# Altium project Current Sensing Board.PrjPCB
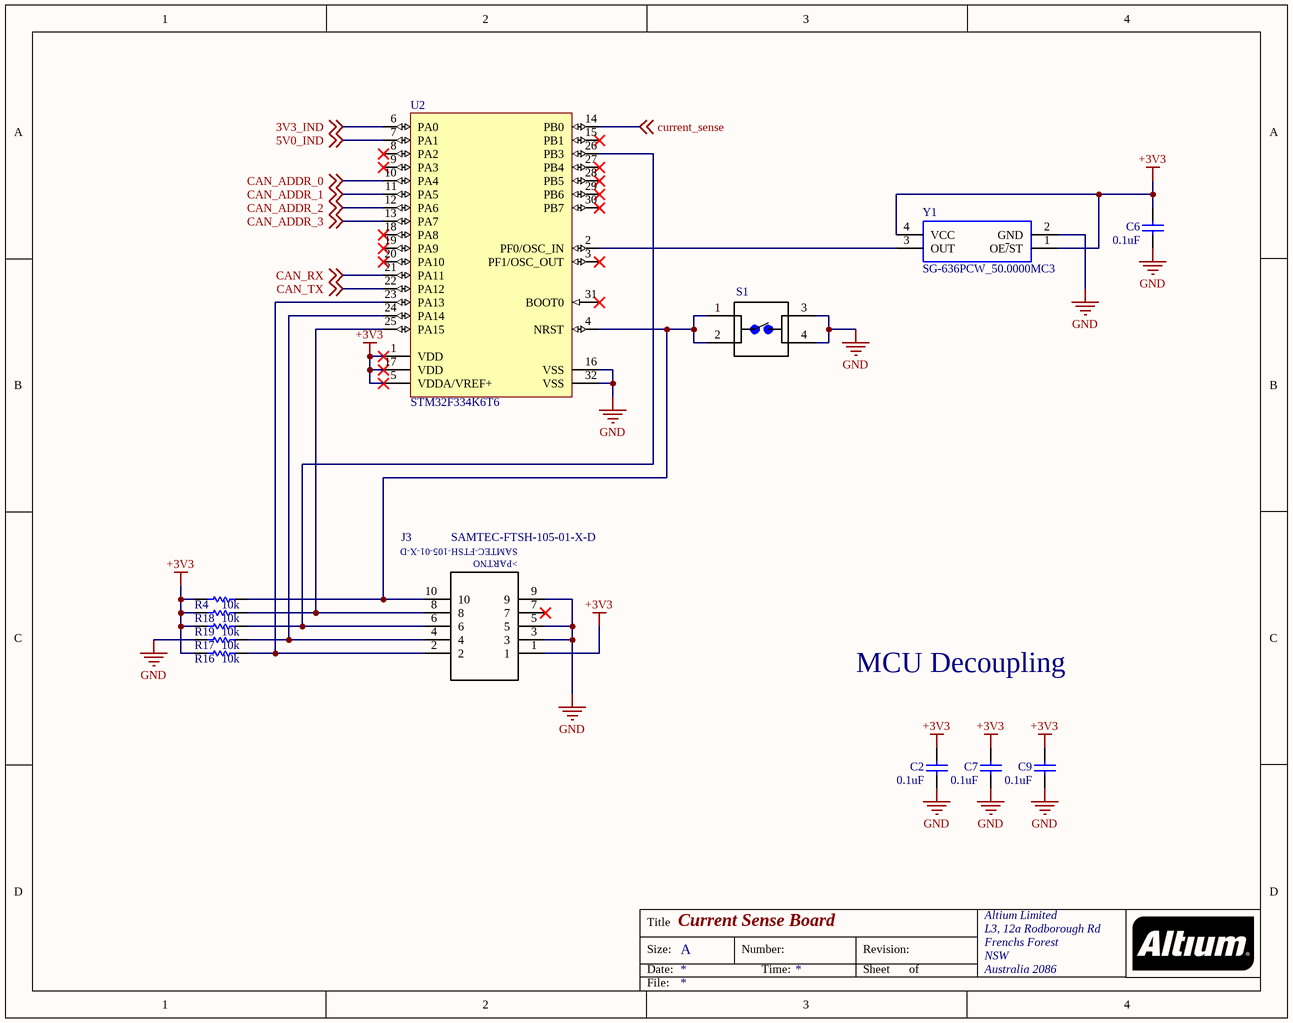
[diagram p0: STM Schematic.SchDoc]
Title: Current Sense Board
4 sheets, 56 parts. Net scope: global (net labels, ports and power ports of the same name join across sheets).
Board file: Current Sensing PCB.PcbDoc
Sheets:
  STM Schematic.SchDoc
  CAN Schematic.SchDoc
  Power Schematic.SchDoc
  Current Sense Schematic.SchDoc

## Sheet STM Schematic.SchDoc: Current Sense Board
size A; Organization: Altium Limited; Address1: L3, 12a Rodborough Rd; Address2: Frenchs Forest; Address3: NSW; Address4: Australia 2086

### Parts
C2  0.1uF  [CAPC0805(2012)75_L]
C6  0.1uF  [CAPC0805(2012)75_L]
C7  0.1uF  [CAPC0805(2012)75_L]
C9  0.1uF  [CAPC0805(2012)75_L]
J3  SAMTEC-FTSH-105-01-X-D  [SAMTEC-FTSH-105-01-X-D]
R4  10k  [RESC2013X70X40LL20T20]
R16  10k  [RESC2013X70X40LL20T20]
R17  10k  [RESC2013X70X40LL20T20]
R18  10k  [RESC2013X70X40LL20T20]
R19  10k  [RESC2013X70X40LL20T20]
S1  1825910-7  [Switch 6mm 24V (NO)]  (value not drawn)
U2  STM32F334K6T6  [STM-LQFP32_N]
Y1  SG-636PCW_50.0000MC3  [SG-636]

### Nets
+3V3: C2.2 C6.2 C7.2 C9.2 J3.1 R4.1 R16.1 R18.1 R19.1 U2.1(VDD) U2.5(VDDA/VREF+) U2.17(VDD) Y1.1(OE~{/}ST) Y1.4(VCC)
GND: C2.1 C6.1 C7.1 C9.1 J3.3 J3.5 J3.9 R17.1 S1.3 S1.4 U2.16(VSS) U2.32(VSS) Y1.2(GND)
3V3_IND: U2.6(PA0) ; off-sheet 3V3_IND
5V0_IND: U2.7(PA1) ; off-sheet 5V0_IND
CAN_ADDR_0: U2.10(PA4) ; off-sheet CAN_ADDR_0
CAN_ADDR_1: U2.11(PA5) ; off-sheet CAN_ADDR_1
CAN_ADDR_2: U2.12(PA6) ; off-sheet CAN_ADDR_2
CAN_ADDR_3: U2.13(PA7) ; off-sheet CAN_ADDR_3
CAN_RX: U2.21(PA11) ; off-sheet CAN_RX
CAN_TX: U2.22(PA12) ; off-sheet CAN_TX
current_sense: U2.14(PB0) ; off-sheet current_sense
NetJ3_2: J3.2 R16.2 U2.23(PA13)
NetJ3_4: J3.4 R17.2 U2.24(PA14)
NetJ3_6: J3.6 R19.2 U2.26(PB3)
NetJ3_8: J3.8 R18.2 U2.25(PA15)
NetJ3_10: J3.10 R4.2 S1.1 S1.2 U2.4(NRST)
NetU2_2: U2.2(PF0/OSC_IN) Y1.3(OUT)

Not connected (* = marked no-connect by the designer): J3 7*; U2 3(PF1/OSC_OUT)* 8(PA2)* 9(PA3)* 15(PB1)* 18(PA8)* 19(PA9)* 20(PA10)* 27(PB4)* 28(PB5)* 29(PB6)* 30(PB7)* 31(BOOT0)*

### Notes on the sheet
- MCU Decoupling
- Title
- Size:
- Date:
- A
- Number:
- Time:
- Revision:
- Sheet
- of
- File:
- (in symbol SAMTEC-FTSH-105-01-X-D) >PARTNO

### Library data of the parts
C2 C6 C7 C9 = CMP-1036-00339-1: CAP 2.7pF 50V ±0.1pF 0805 (2012 Metric) Thickness 0.75mm SMD; Case-EIA: 0805; Case-Metric: 2012; Tolerance: Â±0.1pF; Rated Voltage: 50 V; Value: 2.7pF; Max Thickness: 0.75 mm; Technology: SMT
R4 R16-R19 = CMP-2001-04440-2: RES SMD 150K OHM 1% 1/8W 0805; Manufacturer: Panasonic; Part Number: ERJ-6ENF1503V; Datasheet: http://industrial.panasonic.com/cdbs/www-data/pdf/RDA0000/AOA0000C86.pdf
S1 = Switch 6mm 24V (NO): FSM4JAH=6MM TACT SWITCH, HIGH TEMP; MF: TE Connectivity; Contact_Current_Rating: 50 mA; Configuration_Pole-Throw: Single Pole - Single Throw; Package: None; Digi-Key_Part_Number: 450-1804-ND; Digi-Key_Purchase_URL: https://www.digikey.com/product-detail/en/te-connectivity-alcoswitch-switches/1825910-7/450-1804-ND/1731414?utm_source=snapeda&utm_medium=aggregator&utm_campaign=symbol; MP: 1825910-7; SnapEDA_Link: https://www.snapeda.com/parts/1825910-7/TE%20Connectivity%20ALCOSWITCH%20Switches/view-part/?ref=snap; EU_RoHS_Compliance: Compliant; TE_purchase_URL: https://www.te.com/usa-en/product-1825910-7.html?te_bu=Cor&te_type=disp&te_campaign=seda_glo_cor-seda-global-disp-prtnr-fy19-seda-model-bom-cta_sma-317_1&elqCampaignId=32493; Value: *
U2 = STM32F334K6T6: ARM Cortex-M4 32-bit MCU, 32-Pin LQFP, 32 KB Flash, 16 KB Internal RAM, 25 I/Os, -40 to 85 degC, Tray; D/A Converter: 3; Internal RAM Size (kB): 16; I/Os (High Current): 25; Supply Voltage(Vcc) min (V): 2; Operating Frequency(F) (Processor speed) (MHz): 72; FLASH Size (Prog) (kB): 32; ComponentLink1Description: Manufacturer URL; Mounting Technology: Surface Mount; ComponentLink1URL: http://www.st.com/; Package Description: 32-Pin Low Profile Quad Flat Package, 7 x 7 mm Body, 0.8 mm Pitch; ComponentLink2URL: http://www.st.com/st-web-ui/static/active/en/resource/technical/document/datasheet/DM00097745.pdf; Packing: Tray; Package Reference: LQFP32; Core: ARM Cortex-M4; ComponentLink2Description: Datasheet; DatasheetVersion: Rev. 4
Y1 = SG-636PCW_50.0000MC3__ROHS: Standard Clock Oscillators 50MHz 3.3Volt 100ppm -20C +70C; Manufacturer_Name: Epson Timing; Manufacturer_Part_Number: SG-636PCW 50.0000MC3: ROHS; RS Part Number: *; RS Price/Stock: *; Arrow Part Number: SG-636PCW 50.0000MC3: ROHS; Arrow Price/Stock: *; Datasheet Link: http://www.mouser.com/ds/2/137/G-636PCE_en-1003252.pdf

## Sheet CAN Schematic.SchDoc: Current Sense Board
size A
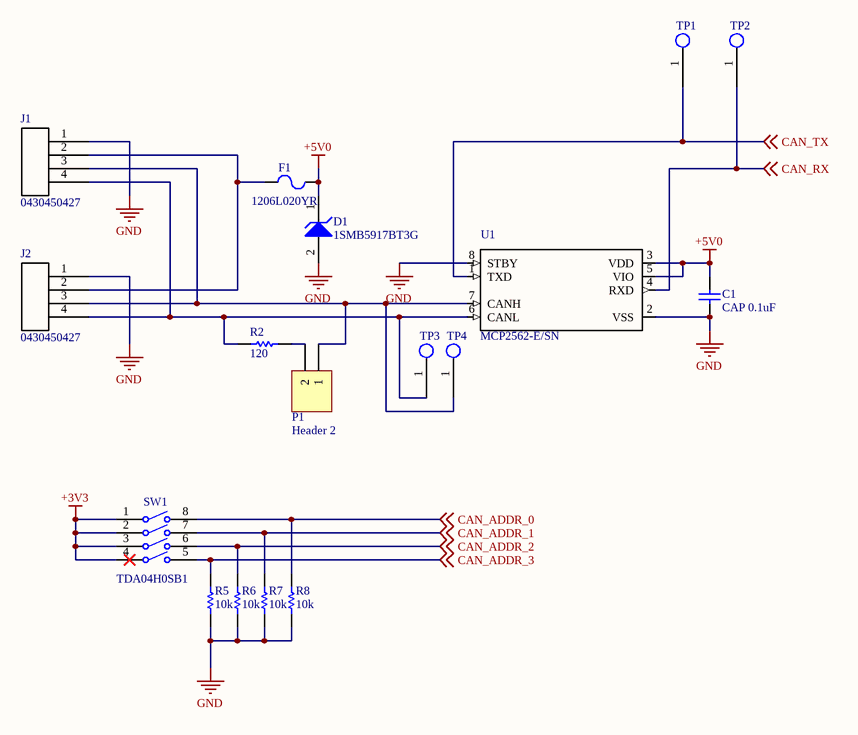
[diagram p1: CAN Schematic.SchDoc]

### Parts
C1  CAP 0.1uF  [CAPC0805(2012)75_L]
D1  1SMB5917BT3G  [ONSC-SMB-2-403A-03_H_V]
F1  1206L020YR  [LFUS-1206L020YR_V]
J1  0430450427  [0430450427]
J2  0430450427  [0430450427]
P1  Header 2  [HDR1X2]
R2  120  [RESC2013X70X40LL20T20]
R5  10k  [RESC2013X70X40LL20T20]
R6  10k  [RESC2013X70X40LL20T20]
R7  10k  [RESC2013X70X40LL20T20]
R8  10k  [RESC2013X70X40LL20T20]
SW1  TDA04H0SB1  [CKCP-TDA04H0SB1R_V]
TP1  Test Point  [Test Point Through-hole]  (value not drawn)
TP2  Test Point  [Test Point Through-hole]  (value not drawn)
TP3  Test Point  [Test Point Through-hole]  (value not drawn)
TP4  Test Point  [Test Point Through-hole]  (value not drawn)
U1  MCP2562-E/SN  [SOIC127P600X175-8N]

### Nets
+3V3: SW1.1 SW1.2 SW1.3 SW1.4
+5V0: C1.2 D1.1(K) F1.2 U1.3(VDD) U1.5(VIO)
GND: C1.1 D1.2(A) J1.1 J2.1 R5.2 R6.2 R7.2 R8.2 U1.2(VSS) U1.8(STBY)
CAN_ADDR_0: R8.1 SW1.8 ; off-sheet CAN_ADDR_0
CAN_ADDR_1: R7.1 SW1.7 ; off-sheet CAN_ADDR_1
CAN_ADDR_2: R6.1 SW1.6 ; off-sheet CAN_ADDR_2
CAN_ADDR_3: R5.1 SW1.5 ; off-sheet CAN_ADDR_3
CAN_RX: TP2.1 U1.4(RXD) ; off-sheet CAN_RX
CAN_TX: TP1.1 U1.1(TXD) ; off-sheet CAN_TX
NetF1_1: F1.1 J1.2 J2.2
NetJ1_3: J1.3 J2.3 P1.1 TP4.1 U1.7(CANH)
NetJ1_4: J1.4 J2.4 R2.2 TP3.1 U1.6(CANL)
NetP1_2: P1.2 R2.1

### Notes on the sheet
- Title
- Size:
- Date:
- A
- Number:
- Time:
- Revision:
- Sheet
- of
- File:

### Library data of the parts
C1 = CMP-1036-00339-1: as C2 on sheet STM Schematic; Rated Voltage: 50 V; Value: 2.7pF; Max Thickness: 0.75 mm; Technology: SMT
D1 = CMP-1060-00195-1: 3 W Zener Voltage Regulator, 2-Pin SMB, Pb-Free, Tape and Reel; Manufacturer: On Semiconductor; VZ Typ (V): 4.7; RoHS: Pb-Free; ComponentLink1Description: Manufacturer URL; ComponentLink2URL: http://www.onsemi.com/pub_link/Collateral/1SMB5913BT3-D.PDF; Mounting Technology: Surface Mount; PackageVersion: Rev. H, 05/2011; DatasheetVersion: Rev. 8; Packing: Tape and Reel; PartNumber: 1SMB5917BT3G; ComponentLink2Description: Datasheet; ComponentLink3Description: Package Specification; PackageReference: SMB-2-403A-03_H; ComponentLink1URL: http://www.onsemi.com/; PackageDescription: 2-Pin Small Molded Package, J-Bend Lead, Body 4.33 x 3.625 mm; ComponentLink3URL: http://www.onsemi.com/pub_link/Collateral/1SMB5913BT3-D.PDF
F1 = CMP-2000-05472-1: PTC Resettable Fuse, 100 A, 0.6W, -40 to 85 degC, 2-Pin SMD, RoHS, Tape and Reel; Manufacturer: Littelfuse; Hold Current [Ih]: 0.2A; Working Voltage-Max: 24V; Trip Current: 0.42A; Operating Temp Range: -40to+85°C; Size: 1206; Manufacturer URL: http://www.littelfuse.com/; Datasheet Version: 02/2015; Mounting Technology: SurfaceMount; Datasheet URL: http://download.siliconexpert.com/pdfs/2015/4/10/21/0/43/983/ltf_/manual/3609284120511713636092822459449496littelfuse_ptc_1206l_datasheet.pdf.pdf.pdf; Package Description: 2-Pin Surface Mount Device, Body 3.2 x 1.65 mm; Package Reference: 1206L020YR
J1 J2 = 0430450427-Single row schematic: Molex micro-fit 3.0 dual row header. P/N 0430450427
P1 = Header 2: Header, 2-Pin; LatestRevisionDate: 17-Jul-2002; LatestRevisionNote: Re-released for DXP Platform.; Publisher: Altium Limited
R2 R5-R8 = CMP-2001-04440-2: as R4 on sheet STM Schematic; Datasheet: http://industrial.panasonic.com/cdbs/www-data/pdf/RDA0000/AOA0000C86.pdf
SW1 = SMD Half-Pitch Dip Switch Array: Ultra-Miniature Surface Mount Half-Pitch DIP Switch, 25 mA, 24 V, -40 to 85 degC, 8-Pin SMD, RoHS, Tube; Contact Current Rating: 100 mA; Throw Configuration: SPST; Voltage Rating (DC): 24 V; Max Contact Resistance: 100 mohm; Max Current Rating: 25 mA; REACH SVHC: No SVHC; DatasheetVersion: 02/2016; Case\Package: DIP; Package Quantity: 70; Lead Pitch: 1.27 mm; Contact Plating: Gold; Packaging: Rail/Tube; Contact Finish: Gold; Mount: Surface Mount; Height: 2.3 mm; Contact Material: Copper; Max Operating Temperature: 85 degC; Max Voltage Rating (DC): 24 V; ComponentLink1URL: http://www.ck-components.com/media/1328/tda.pdf; PackageDescription: 8-Pin Surface Mount Device, Body 6.21 x 6.2 mm, Pitch 1.27 mm; Radiation Hardening: No; ComponentLink1Description: Datasheet; Current Rating: 100 mA; RoHSCompliant: true; PackageReference: TDA04H0SB1R; Min Operating Temperature: -40 degC; Pins: 4; Mounting Technology: Surface Mount; Length: 6.21 mm
U1 = MCP2562-E/SN: Microchip MCP2562-E/SN, CAN Transceiver 1MBps 1-channel IEC 61000-4-2, 8-Pin SOIC; Price: None; MF: Microchip; SnapEDA_Link: https://www.snapeda.com/parts/MCP2562-E/SN/Microchip/view-part/?ref=snap; MP: MCP2562-E/SN; Availability: Unavailable; Package: SO-8 Microchip; Value: *

## Sheet Power Schematic.SchDoc: Current Sense Board
size A
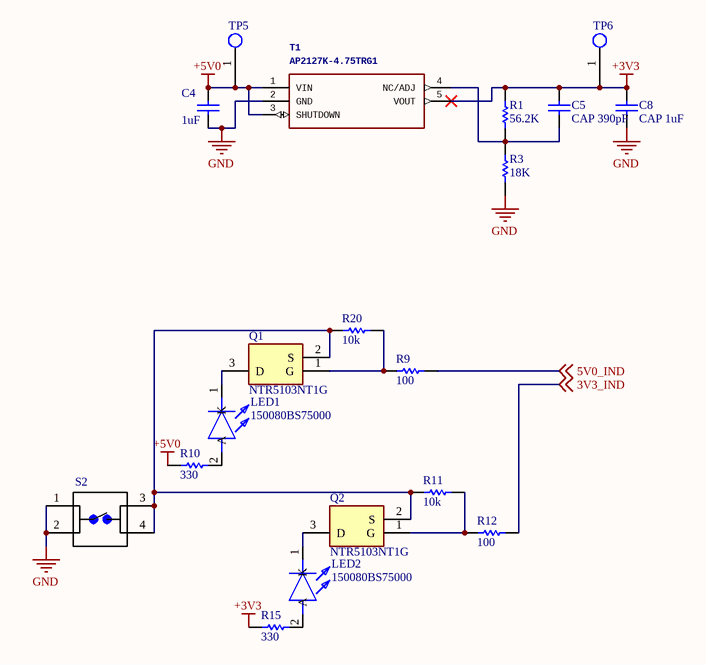
[diagram p2: Power Schematic.SchDoc]

### Parts
C4  1uF  [CAPC0805(2012)75_L]
C5  CAP 390pF  [CAPC0805(2012)75_L]
C8  CAP 1uF  [CAPC0805(2012)75_L]
LED1  150080BS75000  [LEDC2012X80N]
LED2  150080BS75000  [LEDC2012X80N]
Q1  NTR5103NT1G  [SOT95P237X101-3N]
Q2  NTR5103NT1G  [SOT95P237X101-3N]
R1  56.2K  [RESC2013X70X40LL20T20]
R3  18K  [RESC2013X70X40LL20T20]
R9  100  [RESC2013X70X40LL20T20]
R10  330  [RESC2013X70X40LL20T20]
R11  10k  [RESC2013X70X40LL20T20]
R12  100  [RESC2013X70X40LL20T20]
R15  330  [RESC2013X70X40LL20T20]
R20  10k  [RESC2013X70X40LL20T20]
S2  1825910-7  [Switch 6mm 24V (NO)]  (value not drawn)
T1  AP2127K-4.75TRG1  [SOT95P282X145-5N]
TP5  Test Point  [Test Point Through-hole]  (value not drawn)
TP6  Test Point  [Test Point Through-hole]  (value not drawn)

### Nets
+3V3: C5.2 C8.2 R1.1 R15.1 T1.5(VOUT) TP6.1
+5V0: C4.2 R10.2 T1.1(VIN) T1.3(SHUTDOWN) TP5.1
GND: C4.1 C8.1 R3.2 S2.1 S2.2 T1.2(GND)
3V3_IND: R12.1 ; off-sheet 3V3_IND
5V0_IND: R9.1 ; off-sheet 5V0_IND
NetC5_1: C5.1 R1.2 R3.1 T1.4(NC/ADJ)
NetLED1_1: LED1.1(K) Q1.3(D)
NetLED1_2: LED1.2(A) R10.1
NetLED2_1: LED2.1(K) Q2.3(D)
NetLED2_2: LED2.2(A) R15.2
NetQ1_1: Q1.1(G) R9.2 R20.1
NetQ1_2: Q1.2(S) Q2.2(S) R11.2 R20.2 S2.3 S2.4
NetQ2_1: Q2.1(G) R11.1 R12.2

### Notes on the sheet
- Title
- Size:
- Date:
- A
- Number:
- Time:
- Revision:
- Sheet
- of
- File:

### Library data of the parts
C4 C5 C8 = CMP-1036-00339-1: as C2 on sheet STM Schematic; Rated Voltage: 50 V; Value: 2.7pF; Max Thickness: 0.75 mm; Technology: SMT
LED1 LED2 = 150080BS75000: LED; Manufacturer_Name: Wurth Elektronik; Datasheet Link: https://katalog.we-online.com/led/datasheet/150080BS75000.pdf; Height: 0.8mm; Manufacturer_Part_Number: 150080BS75000; Mouser Part Number: 710-150080BS75000; Mouser Price/Stock: https://www.mouser.com/Search/Refine.aspx?Keyword=710-150080BS75000; RS Part Number: 8154228P; RS Price/Stock: http://uk.rs-online.com/web/p/products/8154228P
Q1 Q2 = NTR5103NT1G: N-MOSFET; Manufacturer_Name: ON Semiconductor; Datasheet Link: https://componentsearchengine.com/Datasheets/1/NTR5103NT1G.pdf; Height: 1.01mm; Manufacturer_Part_Number: NTR5103NT1G; Mouser Part Number: 863-NTR5103NT1G; Mouser Price/Stock: https://www.mouser.com/Search/Refine.aspx?Keyword=863-NTR5103NT1G; RS Part Number: 1841331; RS Price/Stock: http://uk.rs-online.com/web/p/products/1841331
R1 R3 R9-R12 R15 R20 = CMP-2001-04440-2: as R4 on sheet STM Schematic; Datasheet: http://industrial.panasonic.com/cdbs/www-data/pdf/RDA0000/AOA0000C86.pdf
S2 = Switch 6mm 24V (NO): as S1 on sheet STM Schematic; Package: None; Digi-Key_Part_Number: 450-1804-ND; Digi-Key_Purchase_URL: https://www.digikey.com/product-detail/en/te-connectivity-alcoswitch-switches/1825910-7/450-1804-ND/1731414?utm_source=snapeda&utm_medium=aggregator&utm_campaign=symbol; MP: 1825910-7; SnapEDA_Link: https://www.snapeda.com/parts/1825910-7/TE%20Connectivity%20ALCOSWITCH%20Switches/view-part/?ref=snap; EU_RoHS_Compliance: Compliant; TE_purchase_URL: https://www.te.com/usa-en/product-1825910-7.html?te_bu=Cor&te_type=disp&te_campaign=seda_glo_cor-seda-global-disp-prtnr-fy19-seda-model-bom-cta_sma-317_1&elqCampaignId=32493; Value: *
T1 = AP2127K-4.75TRG1: LDO Voltage Regulators 300mA CMOS LDO 2.5V to 6VSource:  Datasheet; Manufacturer_Name: Diodes Inc.; GateName_1: G$1; SymbolName_1: AP2127K-4.75TRG1; LibraryName: AP2127K-4.75TRG1; DeviceSetName: AP2127K-4.75TRG1; Package: SOT95P282X145-5N; Manufacturer_Part_Number: AP2127K-4.75TRG1; Height: 1.45mm

## Sheet Current Sense Schematic.SchDoc: Current Sense Board
size A
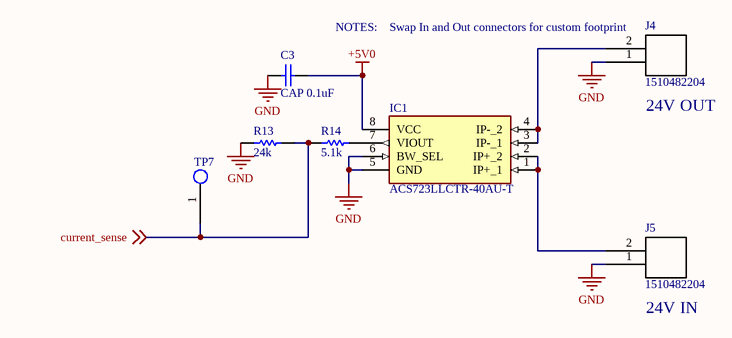
[diagram p3: Current Sense Schematic.SchDoc]

### Parts
C3  CAP 0.1uF  [CAPC0805(2012)75_L]
IC1  ACS723LLCTR-40AU-T  [SOT127P600X175-8N]
J4  1510482204  [1510482204]
J5  1510482204  [1510482204]
R13  24k  [RESC2013X70X40LL20T20]
R14  5.1k  [RESC2013X70X40LL20T20]
TP7  Test Point  [Test Point Through-hole]  (value not drawn)

### Nets
+5V0: C3.2 IC1.8(VCC)
GND: C3.1 IC1.5(GND) IC1.6(BW_SEL) J4.1 J5.1 R13.2
current_sense: R13.1 R14.2 TP7.1 ; off-sheet current_sense
NetIC1_1: IC1.1(IP+_1) IC1.2(IP+_2) J5.2
NetIC1_3: IC1.3(IP-_1) IC1.4(IP-_2) J4.2
NetIC1_7: IC1.7(VIOUT) R14.1

### Notes on the sheet
- NOTES:
- (near J4) Swap In and Out connectors for custom footprint
- (near J4) 24V OUT
- (near J5) 24V IN
- Title
- Size:
- Date:
- A
- Number:
- Time:
- Revision:
- Sheet
- of
- File:

### Library data of the parts
C3 = CMP-1036-00339-1: as C2 on sheet STM Schematic; Rated Voltage: 50 V; Value: 2.7pF; Max Thickness: 0.75 mm; Technology: SMT
IC1 = ACS723LLCTR-40AU-T: Integrated Circuit; Manufacturer_Name: Allegro Microsystems; Datasheet Link: http://www.allegromicro.com/~/media/Files/Datasheets/ACS723-Datasheet.ashx; Height: 1.75mm; Manufacturer_Part_Number: ACS723LLCTR-40AU-T
J4 J5 = 1510482204: Molex 6.5MM 2 pin connector, used for power connections. P/N 1510482204 and similar models.
R13 R14 = CMP-2001-04440-2: as R4 on sheet STM Schematic; Datasheet: http://industrial.panasonic.com/cdbs/www-data/pdf/RDA0000/AOA0000C86.pdf

## Nets that join several sheets
+3V3: STM Schematic (14 pins), CAN Schematic (SW1.1 SW1.2 SW1.3 SW1.4), Power Schematic (6 pins)
+5V0: CAN Schematic (5 pins), Power Schematic (5 pins), Current Sense Schematic (C3.2 IC1.8)
GND: STM Schematic (13 pins), CAN Schematic (10 pins), Power Schematic (6 pins), Current Sense Schematic (6 pins)
3V3_IND: STM Schematic (U2.6), Power Schematic (R12.1)
5V0_IND: STM Schematic (U2.7), Power Schematic (R9.1)
CAN_ADDR_0: STM Schematic (U2.10), CAN Schematic (R8.1 SW1.8)
CAN_ADDR_1: STM Schematic (U2.11), CAN Schematic (R7.1 SW1.7)
CAN_ADDR_2: STM Schematic (U2.12), CAN Schematic (R6.1 SW1.6)
CAN_ADDR_3: STM Schematic (U2.13), CAN Schematic (R5.1 SW1.5)
CAN_RX: STM Schematic (U2.21), CAN Schematic (TP2.1 U1.4)
CAN_TX: STM Schematic (U2.22), CAN Schematic (TP1.1 U1.1)
current_sense: STM Schematic (U2.14), Current Sense Schematic (R13.1 R14.2 TP7.1)